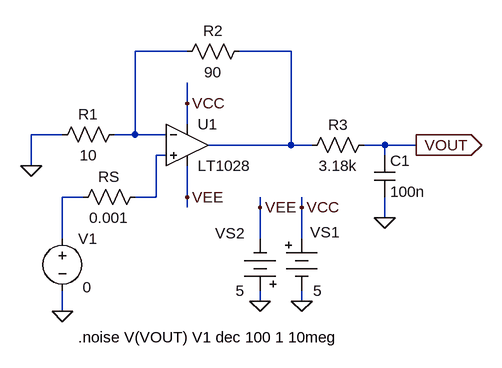
[diagram p0: schematic fig-03-02-16.asc]
fig-03-02-16.asc, the LTspice schematic file:
Version 4
SHEET 1 880 680
WIRE 208 32 128 32
WIRE 368 32 288 32
WIRE 208 112 208 80
WIRE 208 144 208 112
WIRE 16 160 -32 160
WIRE 128 160 128 32
WIRE 128 160 96 160
WIRE 176 160 128 160
WIRE 368 176 368 32
WIRE 368 176 240 176
WIRE 400 176 368 176
WIRE 512 176 480 176
WIRE 560 176 512 176
WIRE 176 192 160 192
WIRE 512 192 512 176
WIRE -32 208 -32 160
WIRE 48 256 16 256
WIRE 160 256 160 192
WIRE 160 256 128 256
WIRE 208 256 208 208
WIRE 208 272 208 256
WIRE 320 272 320 256
WIRE 384 272 384 256
WIRE 512 288 512 256
WIRE 16 320 16 256
WIRE 320 320 320 272
WIRE 384 320 384 272
WIRE 320 416 320 400
WIRE 384 416 384 400
WIRE 16 432 16 400
FLAG 16 432 0
FLAG 320 416 0
FLAG 384 416 0
FLAG 320 272 VEE
FLAG 384 272 VCC
FLAG 208 112 VCC
FLAG 208 256 VEE
FLAG -32 208 0
FLAG 560 176 VOUT
IOPIN 560 176 Out
FLAG 512 288 0
SYMBOL res 304 16 R90
WINDOW 0 0 56 VBottom 2
WINDOW 3 32 56 VTop 2
SYMATTR InstName R2
SYMATTR Value 90
SYMBOL Misc\\battery 384 304 R0
WINDOW 0 13 6 Left 2
WINDOW 3 18 96 Left 2
WINDOW 123 0 0 Left 0
WINDOW 39 0 0 Left 0
SYMATTR InstName VS1
SYMATTR Value 5
SYMBOL Misc\\battery 320 416 R180
WINDOW 0 24 104 Left 2
WINDOW 3 24 16 Left 2
WINDOW 123 0 0 Left 0
WINDOW 39 0 0 Left 0
SYMATTR InstName VS2
SYMATTR Value 5
SYMBOL res 112 144 R90
WINDOW 0 0 56 VBottom 2
WINDOW 3 32 56 VTop 2
SYMATTR InstName R1
SYMATTR Value 10
SYMBOL voltage 16 304 R0
WINDOW 3 31 91 Left 2
WINDOW 123 0 0 Left 0
WINDOW 39 0 0 Left 0
SYMATTR Value 0
SYMATTR InstName V1
SYMBOL Opamps\\LT1028 208 112 R0
SYMATTR InstName U1
SYMBOL res 144 240 R90
WINDOW 0 0 56 VBottom 2
WINDOW 3 32 56 VTop 2
SYMATTR InstName RS
SYMATTR Value 0.001
SYMBOL cap 496 192 R0
SYMATTR InstName C1
SYMATTR Value 100n
SYMBOL res 496 160 R90
WINDOW 0 0 56 VBottom 2
WINDOW 3 32 56 VTop 2
SYMATTR InstName R3
SYMATTR Value 3.18k
TEXT 40 472 Left 2 !.noise V(VOUT) V1 dec 100 1 10meg

The netlist it stands for:
* fig-03-02-16.asc
R2 N002 N001 90
VS1 VCC 0 5
VS2 0 VEE 5
R1 N001 0 10
V1 N004 0 0
XU1 N003 N001 VCC VEE N002 LT1028  ; pins In+ In- V+ V- OUT
RS N003 N004 0.001
C1 VOUT 0 100n
R3 VOUT N002 3.18k
.noise V(VOUT) V1 dec 100 1 10meg
.lib LTC.lib
.backanno
.end